# Altium schematic sheet BRAKE_rev0.SchDoc
size A4
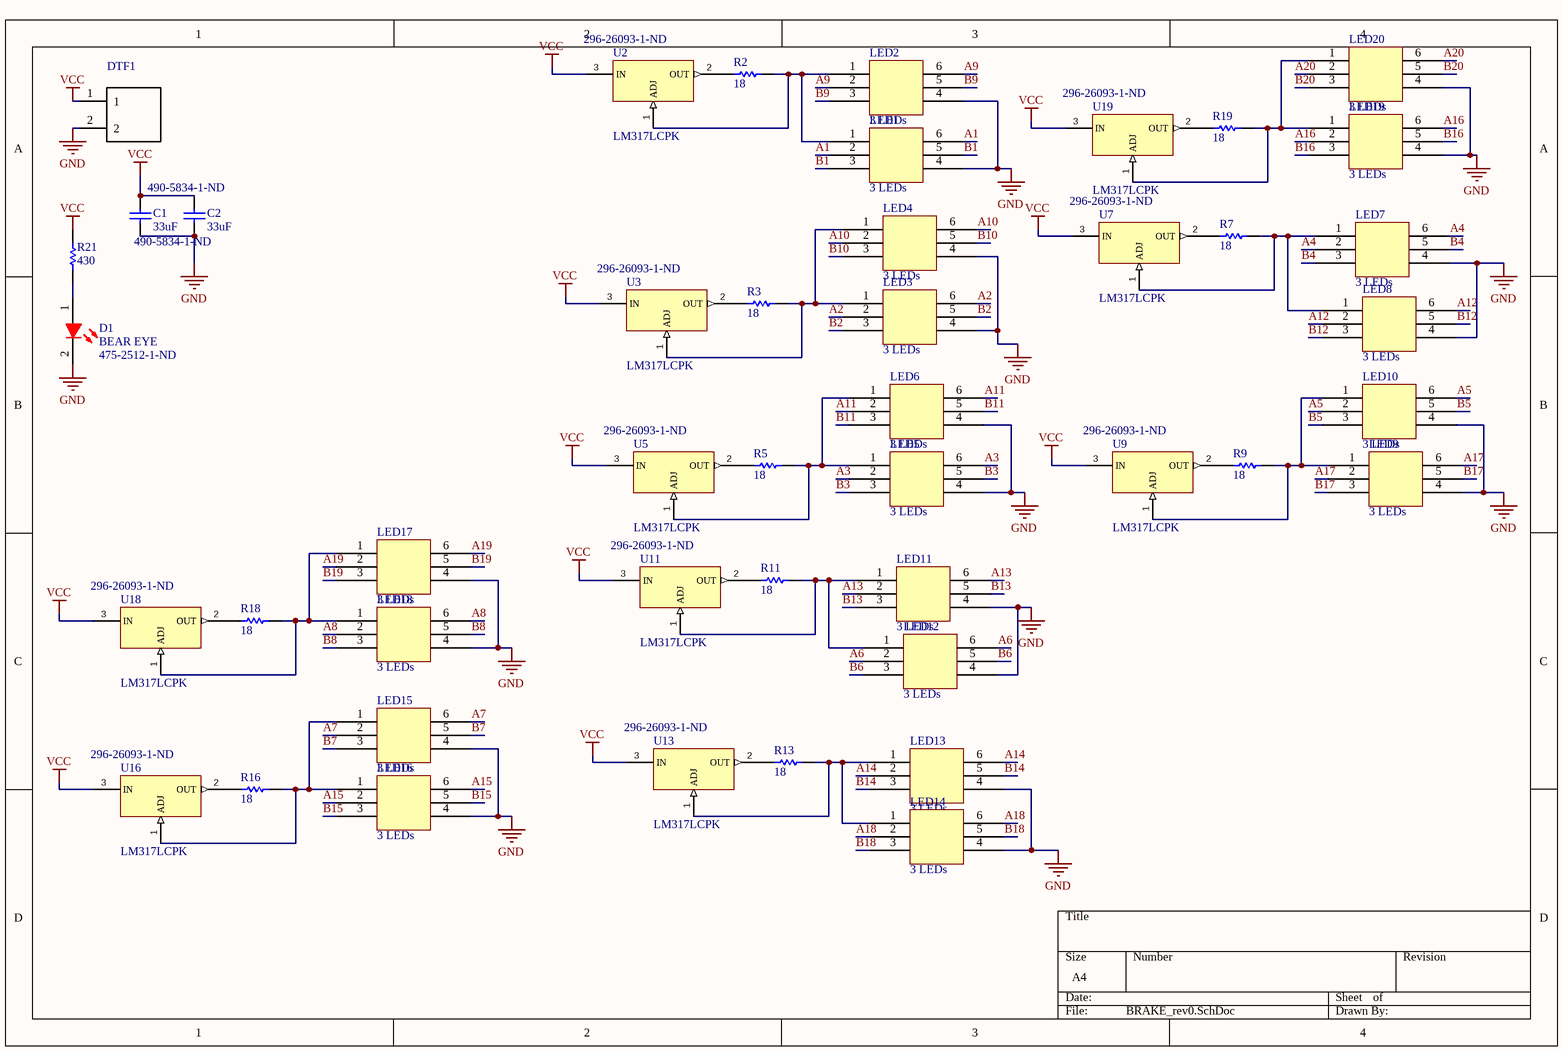
[diagram p0: BRAKE_rev0.SchDoc]

## Parts
C1  value 33uF  Supplier Part Number 1: 490-5834-1-ND  [2J-Lead 6.1 x 5.3]  (hidden comment: Cap Semi)
C2  value 33uF  Supplier Part Number 1: 490-5834-1-ND  [2J-Lead 6.1 x 5.3]  (hidden comment: Cap Semi)
D1  BEAR EYE  Supplier Part Number 1: 475-2512-1-ND  [TOSH-0603LED_RED_V]
DTF1  DTF13-2P  [DTF13-2P]  (value not drawn)
LED1  3 LEDs  [3 channel led]
LED2  3 LEDs  [3 channel led]
LED3  3 LEDs  [3 channel led]
LED4  3 LEDs  [3 channel led]
LED5  3 LEDs  [3 channel led]
LED6  3 LEDs  [3 channel led]
LED7  3 LEDs  [3 channel led]
LED8  3 LEDs  [3 channel led]
LED9  3 LEDs  [3 channel led]
LED10  3 LEDs  [3 channel led]
LED11  3 LEDs  [3 channel led]
LED12  3 LEDs  [3 channel led]
LED13  3 LEDs  [3 channel led]
LED14  3 LEDs  [3 channel led]
LED15  3 LEDs  [3 channel led]
LED16  3 LEDs  [3 channel led]
LED17  3 LEDs  [3 channel led]
LED18  3 LEDs  [3 channel led]
LED19  3 LEDs  [3 channel led]
LED20  3 LEDs  [3 channel led]
R2  18  [RESC0603(1608)_L]
R3  18  [RESC0603(1608)_L]
R5  18  [RESC0603(1608)_L]
R7  18  [RESC0603(1608)_L]
R9  18  [RESC0603(1608)_L]
R11  18  [RESC0603(1608)_L]
R13  18  [RESC0603(1608)_L]
R16  18  [RESC0603(1608)_L]
R18  18  [RESC0603(1608)_L]
R19  18  [RESC0603(1608)_L]
R21  430  [RESC0603(1608)_L]
U2  LM317LCPK  Supplier Part Number 1: 296-26093-1-ND  [LM317LCPK]
U3  LM317LCPK  Supplier Part Number 1: 296-26093-1-ND  [LM317LCPK]
U5  LM317LCPK  Supplier Part Number 1: 296-26093-1-ND  [LM317LCPK]
U7  LM317LCPK  Supplier Part Number 1: 296-26093-1-ND  [LM317LCPK]
U9  LM317LCPK  Supplier Part Number 1: 296-26093-1-ND  [LM317LCPK]
U11  LM317LCPK  Supplier Part Number 1: 296-26093-1-ND  [LM317LCPK]
U13  LM317LCPK  Supplier Part Number 1: 296-26093-1-ND  [LM317LCPK]
U16  LM317LCPK  Supplier Part Number 1: 296-26093-1-ND  [LM317LCPK]
U18  LM317LCPK  Supplier Part Number 1: 296-26093-1-ND  [LM317LCPK]
U19  LM317LCPK  Supplier Part Number 1: 296-26093-1-ND  [LM317LCPK]

## Nets
GND: C1.2 C2.2 D1.2(K) DTF1.2 LED1.4 LED2.4 LED3.4 LED4.4 LED5.4 LED6.4 LED7.4 LED8.4 LED9.4 LED10.4 LED11.4 LED12.4 LED13.4 LED14.4 LED15.4 LED16.4 LED17.4 LED18.4 LED19.4 LED20.4
VCC: C1.1 C2.1 DTF1.1 R21.2 U2.3(IN) U3.3(IN) U5.3(IN) U7.3(IN) U9.3(IN) U11.3(IN) U13.3(IN) U16.3(IN) U18.3(IN) U19.3(IN)
A1: LED1.2 LED1.6
A2: LED3.2 LED3.6
A3: LED5.2 LED5.6
A4: LED7.2 LED7.6
A5: LED10.2 LED10.6
A6: LED12.2 LED12.6
A7: LED15.2 LED15.6
A8: LED18.2 LED18.6
A9: LED2.2 LED2.6
A10: LED4.2 LED4.6
A11: LED6.2 LED6.6
A12: LED8.2 LED8.6
A13: LED11.2 LED11.6
A14: LED13.2 LED13.6
A15: LED16.2 LED16.6
A16: LED19.2 LED19.6
A17: LED9.2 LED9.6
A18: LED14.2 LED14.6
A19: LED17.2 LED17.6
A20: LED20.2 LED20.6
B1: LED1.3 LED1.5
B2: LED3.3 LED3.5
B3: LED5.3 LED5.5
B4: LED7.3 LED7.5
B5: LED10.3 LED10.5
B6: LED12.3 LED12.5
B7: LED15.3 LED15.5
B8: LED18.3 LED18.5
B9: LED2.3 LED2.5
B10: LED4.3 LED4.5
B11: LED6.3 LED6.5
B12: LED8.3 LED8.5
B13: LED11.3 LED11.5
B14: LED13.3 LED13.5
B15: LED16.3 LED16.5
B16: LED19.3 LED19.5
B17: LED9.3 LED9.5
B18: LED14.3 LED14.5
B19: LED17.3 LED17.5
B20: LED20.3 LED20.5
NetD1_1: D1.1(A) R21.1
NetLED1_1: LED1.1 LED2.1 R2.1 U2.1(ADJ)
NetLED3_1: LED3.1 LED4.1 R3.1 U3.1(ADJ)
NetLED5_1: LED5.1 LED6.1 R5.1 U5.1(ADJ)
NetLED7_1: LED7.1 LED8.1 R7.1 U7.1(ADJ)
NetLED9_1: LED9.1 LED10.1 R9.1 U9.1(ADJ)
NetLED11_1: LED11.1 LED12.1 R11.1 U11.1(ADJ)
NetLED13_1: LED13.1 LED14.1 R13.1 U13.1(ADJ)
NetLED15_1: LED15.1 LED16.1 R16.1 U16.1(ADJ)
NetLED17_1: LED17.1 LED18.1 R18.1 U18.1(ADJ)
NetLED19_1: LED19.1 LED20.1 R19.1 U19.1(ADJ)
NetR2_2: R2.2 U2.2(OUT)
NetR3_2: R3.2 U3.2(OUT)
NetR5_2: R5.2 U5.2(OUT)
NetR7_2: R7.2 U7.2(OUT)
NetR9_2: R9.2 U9.2(OUT)
NetR11_2: R11.2 U11.2(OUT)
NetR13_2: R13.2 U13.2(OUT)
NetR16_2: R16.2 U16.2(OUT)
NetR18_2: R18.2 U18.2(OUT)
NetR19_2: R19.2 U19.2(OUT)

## Library data of the parts
C1 C2 = Cap Semi: Capacitor (Semiconductor SIM Model); Published: 8-Jun-2000; LatestRevisionDate: 29-May-2009; LatestRevisionNote: IPC-7351 Footprint Added.; PackageReference: C1206; Publisher: Altium Limited; PackageDescription: Chip Capacitor; Supplier 1: Digi-Key
D1 = CMP-0444-00001-1: LED, Red 0603 (1608) 63mCd; Manufacturer: Toshiba; PartNumber: TLSU1008A(T04); Forward Current: 25 mA; Power Dissipation: 60 mW; Packing Type: Reel; Reverse Voltage: 4 V; Mounting Technology: Surface Mount; PackageDescription: 2-Pin SMT LED, 1.6 x 0.8 mm Pitch; ComponentLink1URL: http://www.toshiba-components.com/; ComponentLink1Description: Manufacturer URL; PackageReference: 0603LED_RED; ComponentLink2URL: http://www.semicon.toshiba.co.jp/info/docget.jsp?type=datasheet&lang=en&pid=TLSU1008A(T04); ComponentLink2Description: Datasheet; DatasheetVersion: Aug-08; Storage Temperature: -40 to 100 degC; Supplier 1: Digi-Key
DTF1 = DTF13-2P: DEUTSCH Automotive; DT RECP ASM; MF: TE Connectivity; SnapEDA_Link: https://www.snapeda.com/parts/DTF13-2P/TE%20Connectivity%20Deutsch%20Connectors/view-part/?ref=snap; Digi-Key_Part_Number: 1734-1033-ND; MP: DTF13-2P; Digi-Key_Purchase_URL: https://www.digikey.ca/product-detail/en/te-connectivity-deutsch-connectors/DTF13-2P/1734-1033-ND/6566597?utm_source=snapeda&utm_medium=aggregator&utm_campaign=symbol; Package: None; EU_RoHS_Compliance: Compliant with Exemptions; TE_purchase_URL: https://www.te.com/usa-en/product-DTF13-2P.html?te_bu=Cor&te_type=disp&te_campaign=seda_glo_cor-seda-global-disp-prtnr-fy19-seda-model-bom-cta_sma-317_1&elqCampaignId=32493; Value: *
LED1-LED20 = CLP6C-RKW-CYBA0AA3: Supplier 1: Digi-Key; Supplier Part Number 1: CLP6C-RKW-CYBA0AA3CT-ND
R2 R3 R5 R7 R9 R11 R13 R16 R18 R19 R21 = CMP-1591-00001-1: 0603 (1608 Metric) Chip Resistor; Case-Metric: 1608; Case-EIA: 0603; PackageReference: RESC0603(1608); Supplier 1: Digi-Key
  R2 R3 R5 R7 R9 R11 R13 R16 R18 R19: Supplier Part Number 1: P17.4AATR-ND
  R21: Supplier Part Number 1: P430BZCT-ND
U2 U3 U5 U7 U9 U11 U13 U16 U18 U19 = LM317LCPK: Supplier 1: Digi-Key